# Altium schematic sheet PWR.SchDoc
size A4; SheetNumber: 1; SheetTotal: 3
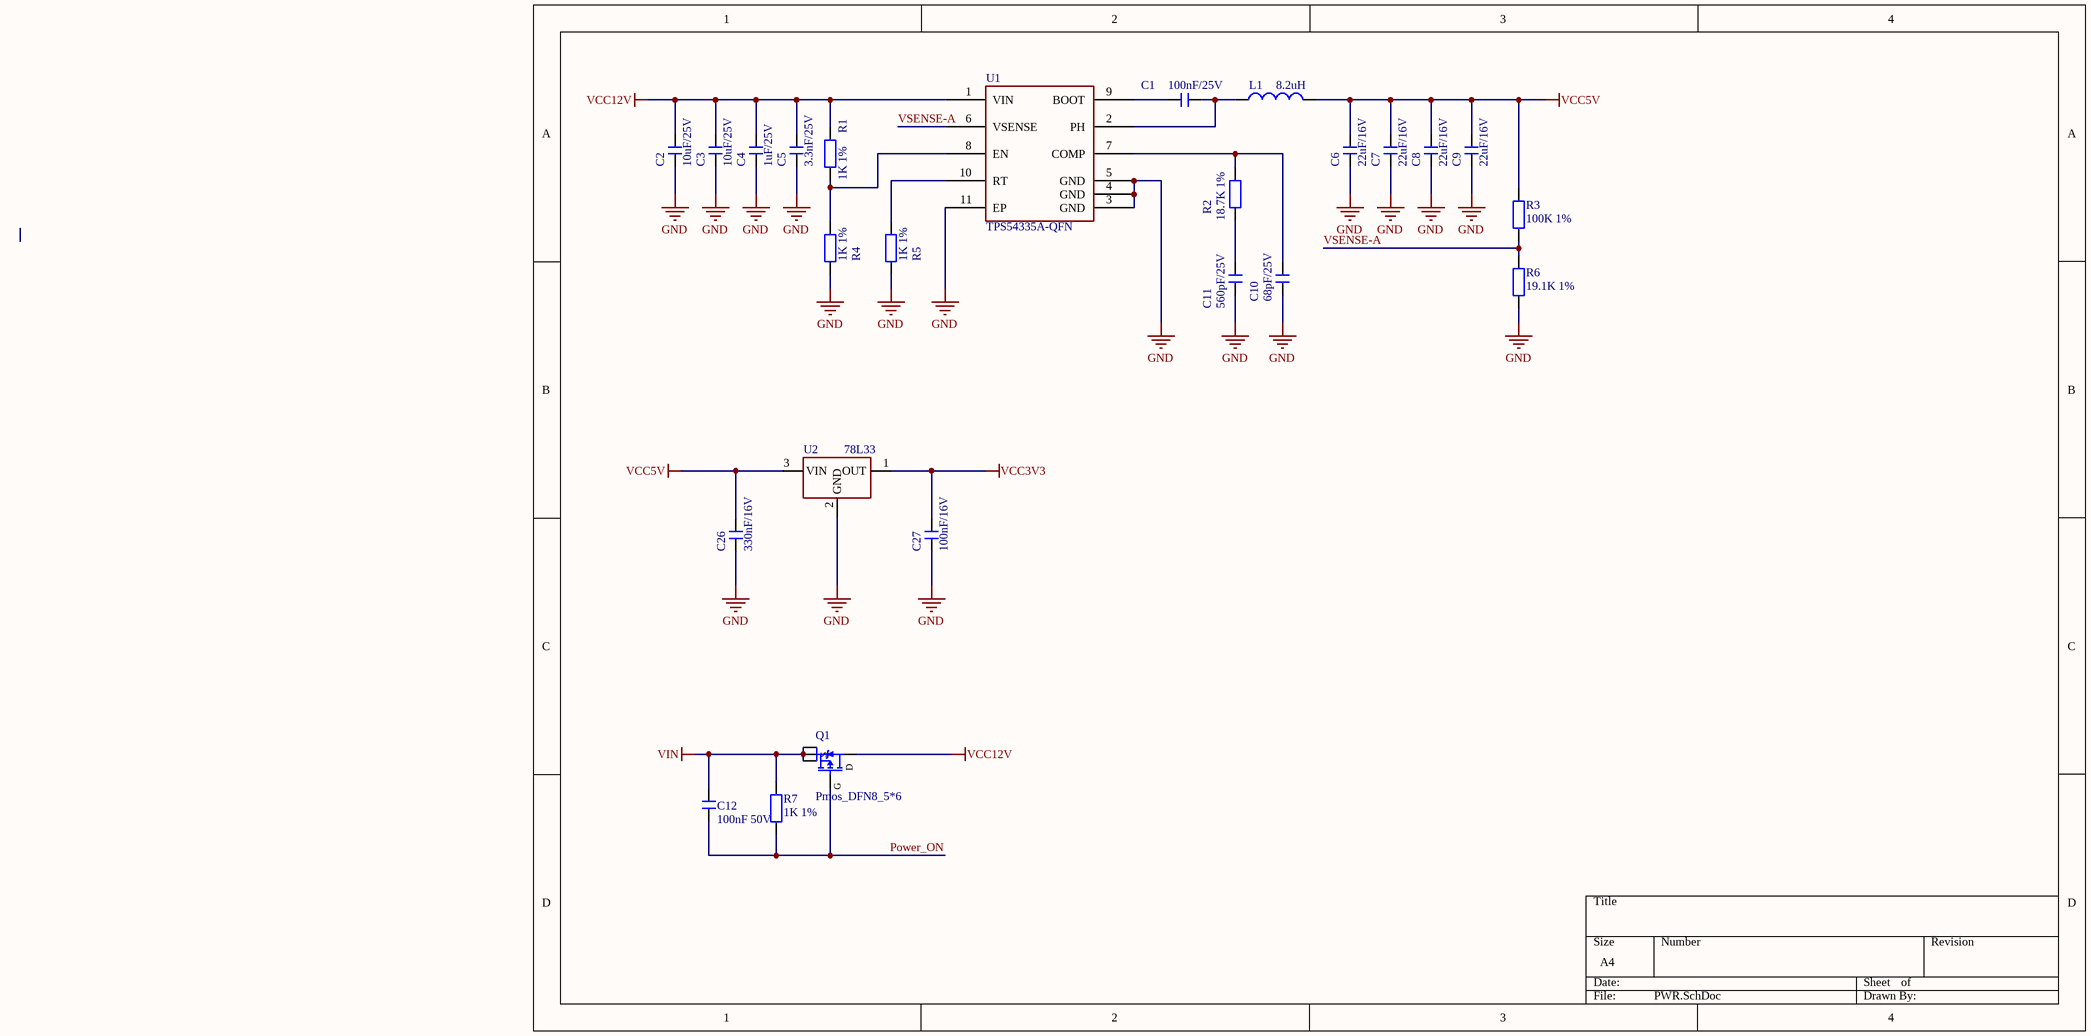
[diagram p0: PWR.SchDoc]

## Parts
C1  100nF/25V  [c0603_l]
C2  10uF/25V  [c0603_l]
C3  10uF/25V  [c0603_l]
C4  1uF/25V  [c0603_l]
C5  3.3nF/25V  [c0603_l]
C6  22uF/16V  [c0603_l]
C7  22uF/16V  [c0603_l]
C8  22uF/16V  [c0603_l]
C9  22uF/16V  [c0603_l]
C10  68pF/25V  [c0603_l]
C11  560pF/25V  [c0603_l]
C12  100nF 50V  [c0603_l]
C26  330nF/16V  [c0603_l]
C27  100nF/16V  [c0603_l]
L1  8.2uH  [NR4020]
Q1  Pmos_DFN8_5*6  [DFN8_5*6]
R1  1K 1%  [r0603_l]
R2  18.7K 1%  [r0603_l]
R3  100K 1%  [r0603_l]
R4  1K 1%  [r0603_l]
R5  1K 1%  [r0603_l]
R6  19.1K 1%  [r0603_l]
R7  1K 1%  [r0603_l]
U1  TPS54335A-QFN  [VSON-10_L3.0-W3.0-P0.50-TL-EP]
U2  78L33  [SOT89_L]

## Nets
GND: C2.1 C3.1 C4.1 C5.1 C6.1 C7.1 C8.1 C9.1 C10.1 C11.1 C26.1 C27.1 R4.2 R5.2 R6.2 U1.3(GND) U1.4(GND) U1.5(GND) U1.11(EP) U2.2(GND)
VCC3V3: C27.2 U2.1(OUT)
VCC5V: C6.2 C7.2 C8.2 C9.2 C26.2 L1.2 R3.1 U2.3(VIN)
VCC12V: C2.2 C3.2 C4.2 C5.2 Q1.5(D) R1.1 U1.1(VIN)
VIN: C12.1 Q1.1(S) Q1.2(S) Q1.3(S) R7.1
Power_ON: C12.2 Q1.4(G) R7.2
VSENSE-A: R3.2 R6.1 U1.6(VSENSE)
NetC1_1: C1.1 L1.1 U1.2(PH)
NetC1_2: C1.2 U1.9(BOOT)
NetC10_2: C10.2 R2.1 U1.7(COMP)
NetC11_2: C11.2 R2.2
NetR1_2: R1.2 R4.1 U1.8(EN)
NetR5_1: R5.1 U1.10(RT)

## Library data of the parts
C1-C12 C26 C27 = C: 无极性贴片电容; 版权归属: 源创客; 材质: X7R; BOM名称: 无极性贴片电容; 学习资源: www.ooocke.com
L1 = L: 小功率贴片电感; 版权归属: 源创客; BOM名称: 小功率贴片电感; 学习资源: www.ooocke.com
Q1 = Pmos_DFN8_5*6: BOM名称: 场效应管; 版权归属: 源创客; 描述: P沟道 30V/4.2A; 学习资源: www.ooocke.com
R1-R7 = R: 贴片电阻; 版权归属: 源创客; BOM名称: 贴片电阻; 学习资源: www.ooocke.com
U1 = TPS54335A-QFN: BUCK